# Altium project zegar_st.PrjPcb
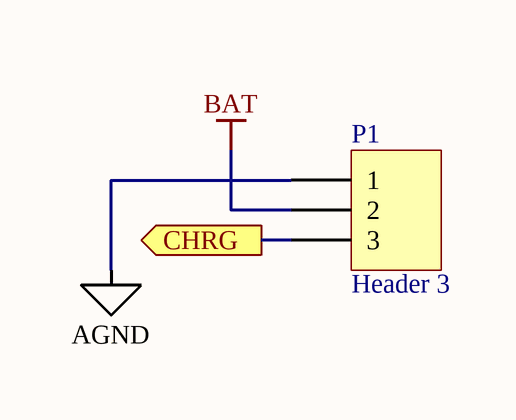
[diagram p0: zegar_st.SchDoc]
1 sheet, 1 parts. Net scope: flat (ports and power ports of the same name join across sheets).
Board file: zegar_st.PcbDoc

## Sheet zegar_st.SchDoc
size A4

### Parts
P1  Header 3  [3SMD]

### Ports
CHRG

### Nets
AGND: P1.1
BAT: P1.2
NetP1_3: P1.3 ; port CHRG

### Library data of the parts
P1 = Header 3: Header, 3-Pin